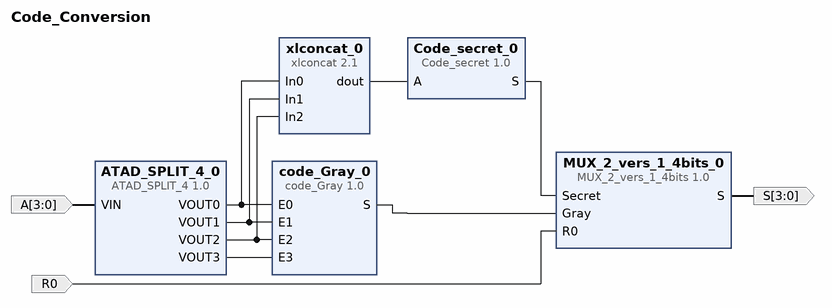
[diagram p0: block diagram of the top level]
# Vivado block design Code_Conversion, xc7a100tcsg324-1, Vivado 2018.3
create_bd_design Code_Conversion

create_bd_port -dir O -from 3 -to 0 S
create_bd_port -dir I R0
create_bd_port -dir I -from 3 -to 0 A

create_bd_cell -type ip -vlnv xilinx.com:user:code_Gray:1.0 code_Gray_0
create_bd_cell -type ip -vlnv xilinx.com:user:Code_secret:1.0 Code_secret_0
create_bd_cell -type ip -vlnv xilinx.com:user:MUX_2_vers_1_4bits:1.0 MUX_2_vers_1_4bits_0
create_bd_cell -type ip -vlnv xilinx.com:user:ATAD_SPLIT_4:1.0 ATAD_SPLIT_4_0
create_bd_cell -type ip -vlnv xilinx.com:ip:xlconcat:2.1 xlconcat_0
set_property -dict {CONFIG.NUM_PORTS 3} [get_bd_cells xlconcat_0]

# ---- connections ----

connect_bd_net [get_bd_pins code_Gray_0/S] [get_bd_pins MUX_2_vers_1_4bits_0/Gray]
connect_bd_net [get_bd_pins Code_secret_0/S] [get_bd_pins MUX_2_vers_1_4bits_0/Secret]
connect_bd_net [get_bd_pins MUX_2_vers_1_4bits_0/S] [get_bd_ports S]
connect_bd_net -net R0_1 [get_bd_ports R0] [get_bd_pins MUX_2_vers_1_4bits_0/R0]
connect_bd_net [get_bd_ports A] [get_bd_pins ATAD_SPLIT_4_0/VIN]
connect_bd_net [get_bd_pins ATAD_SPLIT_4_0/VOUT0] [get_bd_pins code_Gray_0/E0] [get_bd_pins xlconcat_0/In0]
connect_bd_net [get_bd_pins ATAD_SPLIT_4_0/VOUT1] [get_bd_pins code_Gray_0/E1] [get_bd_pins xlconcat_0/In1]
connect_bd_net [get_bd_pins ATAD_SPLIT_4_0/VOUT2] [get_bd_pins code_Gray_0/E2] [get_bd_pins xlconcat_0/In2]
connect_bd_net [get_bd_pins ATAD_SPLIT_4_0/VOUT3] [get_bd_pins code_Gray_0/E3]
connect_bd_net [get_bd_pins xlconcat_0/dout] [get_bd_pins Code_secret_0/A]

validate_bd_design
save_bd_design
